# Altium schematic sheet ADC.SchDoc
size A4
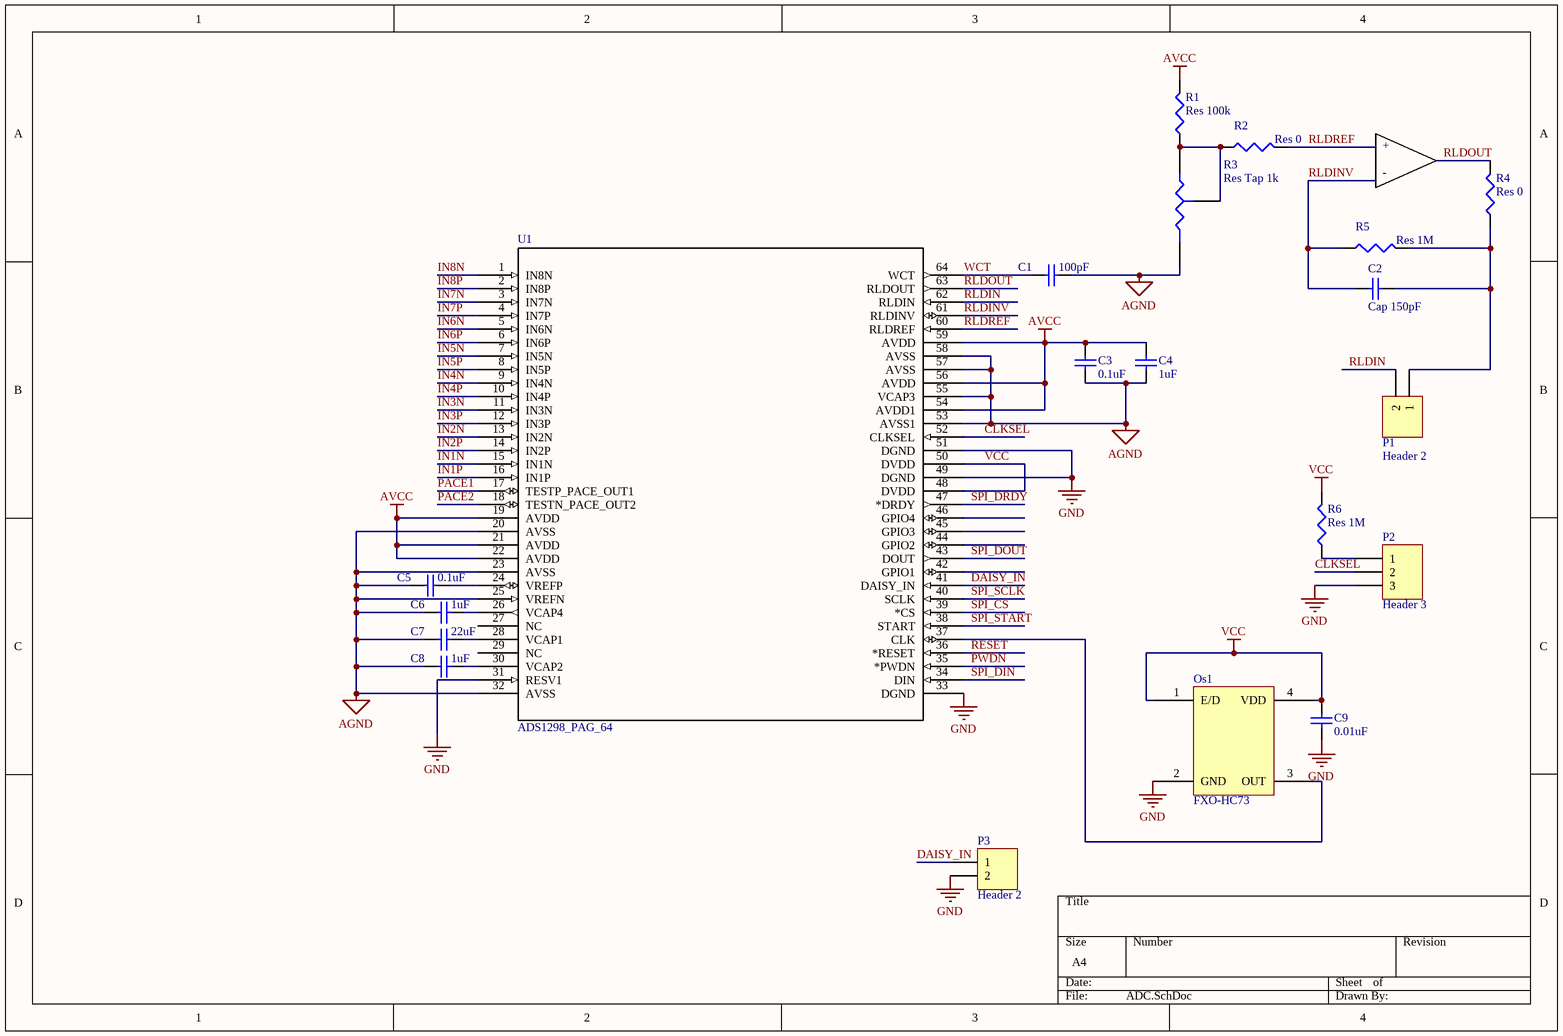
[diagram p0: ADC.SchDoc]

## Parts
C1  value 100pF  [0402]  (hidden comment: Cap 100pF)
C2  Cap 150pF  [0402]
C3  value 0.1uF  [0402]  (hidden comment: Cap 100nF)
C4  value 1uF  [0402]  (hidden comment: Cap 1uF)
C5  value 0.1uF  [0402]  (hidden comment: Cap 100nF)
C6  value 1uF  [0402]  (hidden comment: Cap 1uF)
C7  value 22uF  [0402]  (hidden comment: Cap 22uF)
C8  value 1uF  [0402]  (hidden comment: Cap 1uF)
C9  value 0.01uF  [0402]  (hidden comment: Cap 10nF)
Os1  FXO-HC73  [PCBComponent_1]
P1  Header 2  [HDR1X2]
P2  Header 3  [HDR1X3]
P3  Header 2  [HDR1X2]
R1  Res 100k  [0402]
R2  Res 0  [0402]
R3  Res Tap 1k  [VR4]
R4  Res 0  [0402]
R5  Res 1M  [0402]
R6  Res 1M  [0402]
U1  ADS1298_PAG_64  [PAG64]

## Nets
AGND: C1.1 C3.2 C4.2 C5.2 C6.2 C7.2 C8.2 R3.2(B) U1.20(AVSS) U1.23(AVSS) U1.25(VREFN) U1.32(AVSS) U1.53(AVSS1) U1.55(VCAP3) U1.57(AVSS) U1.58(AVSS)
AVCC: C3.1 C4.1 R1.2 U1.19(AVDD) U1.21(AVDD) U1.22(AVDD) U1.54(AVDD1) U1.56(AVDD) U1.59(AVDD)
GND: C9.2 Os1.2(GND) P2.3 P3.2 U1.31(RESV1) U1.33(DGND) U1.49(DGND) U1.51(DGND)
VCC: C9.1 Os1.1(E/D) Os1.4(VDD) R6.2 U1.48(DVDD) U1.50(DVDD)
CLKSEL: P2.2 U1.52(CLKSEL)
DAISY_IN: P3.1 U1.41(DAISY_IN)
IN1N: U1.15(IN1N)
IN1P: U1.16(IN1P)
IN2N: U1.13(IN2N)
IN2P: U1.14(IN2P)
IN3N: U1.11(IN3N)
IN3P: U1.12(IN3P)
IN4N: U1.9(IN4N)
IN4P: U1.10(IN4P)
IN5N: U1.7(IN5N)
IN5P: U1.8(IN5P)
IN6N: U1.5(IN6N)
IN6P: U1.6(IN6P)
IN7N: U1.3(IN7N)
IN7P: U1.4(IN7P)
IN8N: U1.1(IN8N)
IN8P: U1.2(IN8P)
~{PWD}N: U1.35(*PWDN)
PACE1: U1.17(TESTP_PACE_OUT1)
PACE2: U1.18(TESTN_PACE_OUT2)
~{RESET}: U1.36(*RESET)
RLDIN: P1.2 U1.62(RLDIN)
RLDINV: C2.2 R5.1 U1.61(RLDINV)
RLDOUT: R4.2 U1.63(RLDOUT)
RLDREF: R2.2 U1.60(RLDREF)
SPI_CS: U1.39(*CS)
SPI_DIN: U1.34(DIN)
SPI_DOUT: U1.43(DOUT)
SPI_DRDY: U1.47(*DRDY)
SPI_SCLK: U1.40(SCLK)
SPI_START: U1.38(START)
WCT: C1.2 U1.64(WCT)
NetC2_1: C2.1 P1.1 R4.1 R5.2
NetC5_1: C5.1 U1.24(VREFP)
NetC6_1: C6.1 U1.26(VCAP4)
NetC7_1: C7.1 U1.28(VCAP1)
NetC8_1: C8.1 U1.30(VCAP2)
NetOs1_3: Os1.3(OUT) U1.37(CLK)
NetP2_1: P2.1 R6.1
NetR1_1: R1.1 R2.1 R3.1(A) R3.3(TAP)

Not connected (* = marked no-connect by the designer): U1 27(NC) 29(NC) 42(GPIO1) 44(GPIO2) 45(GPIO3) 46(GPIO4)

## Notes on the sheet
- +
- -

## Library data of the parts
C1 C3-C9 = Cap: Capacitor; Published: 8-Jun-2000; LatestRevisionDate: 17-Jul-2002; LatestRevisionNote: Re-released for DXP Platform.; PackageReference: RAD-0.3; Publisher: Altium Limited; PackageDescription: Radial Cap, Thru-Hole; 2 Leads; 0.3 in Pin Spacing
C2 = Cap Semi: Capacitor (Semiconductor SIM Model); Published: 8-Jun-2000; LatestRevisionDate: 29-May-2009; LatestRevisionNote: IPC-7351 Footprint Added.; PackageReference: C1206; Publisher: Altium Limited; PackageDescription: Chip Capacitor
P1 P3 = Header 2: Header, 2-Pin; LatestRevisionDate: 17-Jul-2002; LatestRevisionNote: Re-released for DXP Platform.; Publisher: Altium Limited
P2 = Header 3: Header, 3-Pin; LatestRevisionDate: 17-Jul-2002; LatestRevisionNote: Re-released for DXP Platform.; Publisher: Altium Limited
R1 R2 R4-R6 = Res3: Resistor; Published: 8-Jun-2000; LatestRevisionDate: 29-May-2009; LatestRevisionNote: IPC-7351 Footprint Added.; PackageReference: J1-0603; Publisher: Altium Limited; PackageDescription: Chip Resistor
R3 = Res Tap: Tapped Resistor; Sim Note: Enter the Resistance value and the set point into parameter fields.; Set Position: 0.5; Published: 24-Mar-1999; LatestRevisionDate: 17-Jul-2002; LatestRevisionNote: Re-released for DXP Platform.; PackageReference: VR3; Publisher: Altium Limited; PackageDescription: Variable Resistor, Thru-Hole; 3 Leads
U1 = ADS1298_PAG_64: Imported; Manufacturer: Texas Instruments; INDUSTRY_STD_PKG_TYPE: TQFP; FAMILY_NAME: ECG / EEG Analog Front End; PIN_COUNT: 64; PACKAGE_DESIGNATOR: PAG; Datasheet URL: http://www.ti.com/lit/gpn/ADS1298; GENERIC_PART_NUMBER: ADS1298; RefDes: RefDes; Type: DEV; Value: Value